# EAGLE schematic xlr_pegelwandler_v_1_2 (EAGLE 6.4)
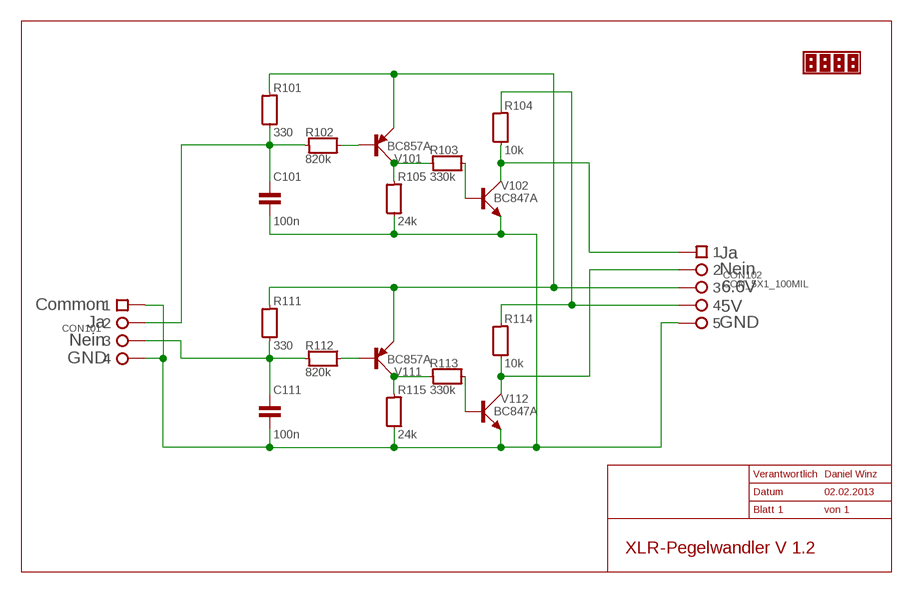
[diagram p0: schematic, sheet 1]

## Parts
C101  100n  KON_V_SMD0805  [C_0805]
C111  100n  KON_V_SMD0805  [C_0805]
CON101  XLR_3P+GXLR_NC3MD-V_NEUTRIK  [XLR_NC3MD-V_NEUTRIK]
CON102  CON_5X1_100MIL  [CON_5X1_100MIL]
R101  330  WID_V_SMD0805  [R_0805]
R102  820k  WID_H_SMD0805  [R_0805]
R103  330k  WID_H_SMD0805  [R_0805]
R104  10k  WID_V_SMD0805  [R_0805]
R105  24k  WID_V_SMD0805  [R_0805]
R111  330  WID_V_SMD0805  [R_0805]
R112  820k  WID_H_SMD0805  [R_0805]
R113  330k  WID_H_SMD0805  [R_0805]
R114  10k  WID_V_SMD0805  [R_0805]
R115  24k  WID_V_SMD0805  [R_0805]
U$1  LP_NUMBER08_SILK_TOP  [LP_NUMBER_SILK_TOP]
V101  BC857A  PNP_VSOT23  [SOT23]
V102  BC847A  NPN_VSOT23  [SOT23]
V111  BC857A  PNP_VSOT23  [SOT23]
V112  BC847A  NPN_VSOT23  [SOT23]

## Nets
CON101: C101.P$1 CON101.2 R101.P$1 R102.P$1
N$2: R103.P$2 V102.1(B)
N$3: R113.P$2 V112.1(B)
N$4: CON102.P$2 R114.P$1 V112.3(C)
N$5: CON102.P$1 R104.P$1 V102.3(C)
N$6: R102.P$2 V101.1(P$B)
N$8: R103.P$1 R105.P$2 V101.3(P$C)
N$9: R113.P$1 R115.P$2 V111.3(P$C)
N$10: CON102.P$3 R101.P$2 R111.P$2 V101.2(P$E) V111.2(P$E)
N$11: R112.P$2 V111.1(P$B)
N$12: C111.P$1 CON101.3 R111.P$1 R112.P$1
N$18: CON102.P$4 R104.P$2 R114.P$2
V102: C101.P$2 C111.P$2 CON101.1 CON101.G CON102.P$5 R105.P$1 R115.P$1 V102.2(E) V112.2(E)

## Notes on the sheet
- Ja
- Nein
- 6.6V
- Common | 5V
- Ja | GND
- Nein
- GND
- Verantwortlich | Daniel Winz
- Datum | 02.02.2013
- Blatt 1 | von 1
- XLR-Pegelwandler V 1.2

## Library data of the parts
C101 C111 = VOW_RCD:KON_V_SMD
CON101 = Winz:XLR_3P+G
CON102 = Winz:CON_5X1_100MIL
R101 R104 R105 R111 R114 R115 = VOW_RCD:WID_V_SMD
R102 R103 R112 R113 = VOW_RCD:WID_H_SMD
U$1 = Platinensammler:LP_NUMBER: Teilnutzenindex Um die einzelnen Teile einer Sammelbestellung schnell und zuverlässig zuordnen zu können, muss jedes Layout eine Markierung erhalten. Da diese Markierung nicht mehr Einfluss auf ein Layout nehmen soll als umbedingt nötig, stellt dieses Device für jede verfügbare Lage einen Plathalter bereit der individuell plaziert werden kann. Rückfragen und oder Anmerkungen bitte an platinensammler@gmail.com
V101 V111 = VOW_TRANSISTOR:PNP_V
V102 V112 = VOW_TRANSISTOR:NPN_V